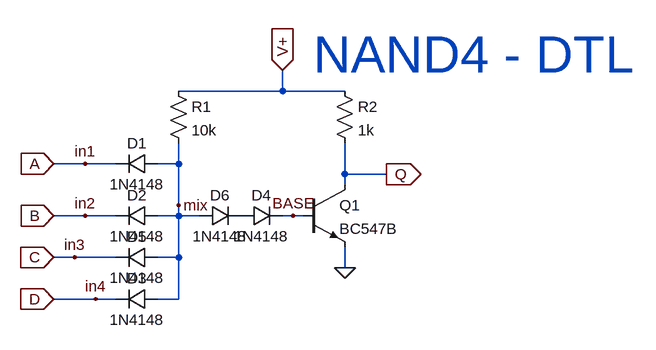
[diagram p0: schematic NAND4.asc]
NAND4.asc, the LTspice schematic file:
Version 4
SHEET 1 880 680
WIRE 288 -48 288 -80
WIRE 288 -48 128 -48
WIRE 384 -48 288 -48
WIRE -16 64 -64 64
WIRE 32 64 -16 64
WIRE 128 64 128 32
WIRE 128 64 96 64
WIRE 384 80 384 32
WIRE 448 80 384 80
WIRE 384 96 384 80
WIRE 128 128 128 64
WIRE -16 144 -64 144
WIRE 32 144 -16 144
WIRE 128 144 128 128
WIRE 128 144 96 144
WIRE 160 144 128 144
WIRE 304 144 288 144
WIRE 320 144 304 144
WIRE -32 208 -64 208
WIRE 32 208 -32 208
WIRE 128 208 128 144
WIRE 128 208 96 208
WIRE 384 224 384 192
WIRE 0 272 -64 272
WIRE 32 272 0 272
WIRE 128 272 128 208
WIRE 128 272 96 272
FLAG 384 224 0
FLAG 448 80 Q
IOPIN 448 80 Out
FLAG -64 64 A
IOPIN -64 64 In
FLAG -64 144 B
IOPIN -64 144 In
FLAG 288 -80 V+
IOPIN 288 -80 In
FLAG 128 128 mix
FLAG -64 208 C
IOPIN -64 208 In
FLAG -64 272 D
IOPIN -64 272 In
FLAG 304 144 BASE
FLAG -16 64 in1
FLAG -16 144 in2
FLAG -32 208 in3
FLAG 0 272 in4
SYMBOL diode 96 48 R90
WINDOW 0 0 32 VBottom 2
WINDOW 3 32 32 VTop 2
SYMATTR InstName D1
SYMATTR Value 1N4148
SYMBOL res 112 -64 R0
SYMATTR InstName R1
SYMATTR Value 10k
SYMBOL npn 320 96 R0
SYMATTR InstName Q1
SYMATTR Value BC547B
SYMBOL res 368 -64 R0
SYMATTR InstName R2
SYMATTR Value 1k
SYMBOL diode 96 128 R90
WINDOW 0 0 32 VBottom 2
WINDOW 3 32 32 VTop 2
SYMATTR InstName D2
SYMATTR Value 1N4148
SYMBOL diode 224 160 R270
WINDOW 0 32 32 VTop 2
WINDOW 3 0 32 VBottom 2
SYMATTR InstName D4
SYMATTR Value 1N4148
SYMBOL diode 96 192 R90
WINDOW 0 0 32 VBottom 2
WINDOW 3 32 32 VTop 2
SYMATTR InstName D5
SYMATTR Value 1N4148
SYMBOL diode 96 256 R90
WINDOW 0 0 32 VBottom 2
WINDOW 3 32 32 VTop 2
SYMATTR InstName D3
SYMATTR Value 1N4148
SYMBOL diode 160 160 R270
WINDOW 0 32 32 VTop 2
WINDOW 3 0 32 VBottom 2
SYMATTR InstName D6
SYMATTR Value 1N4148
TEXT 336 -104 Left 6 ;NAND4 - DTL

The netlist it stands for:
* NAND4.asc
D1 mix in1 1N4148
R1 V+ mix 10k
Q1 Q BASE 0 0 BC547B
R2 V+ Q 1k
D2 mix in2 1N4148
D4 P001 BASE 1N4148
D5 mix in3 1N4148
D3 mix in4 1N4148
D6 mix P001 1N4148
.model D D
.lib standard.dio
.model NPN NPN
.model PNP PNP
.lib standard.bjt
* NAND4 - DTL
.backanno
.end